# EAGLE design supply (EAGLE 6.3)
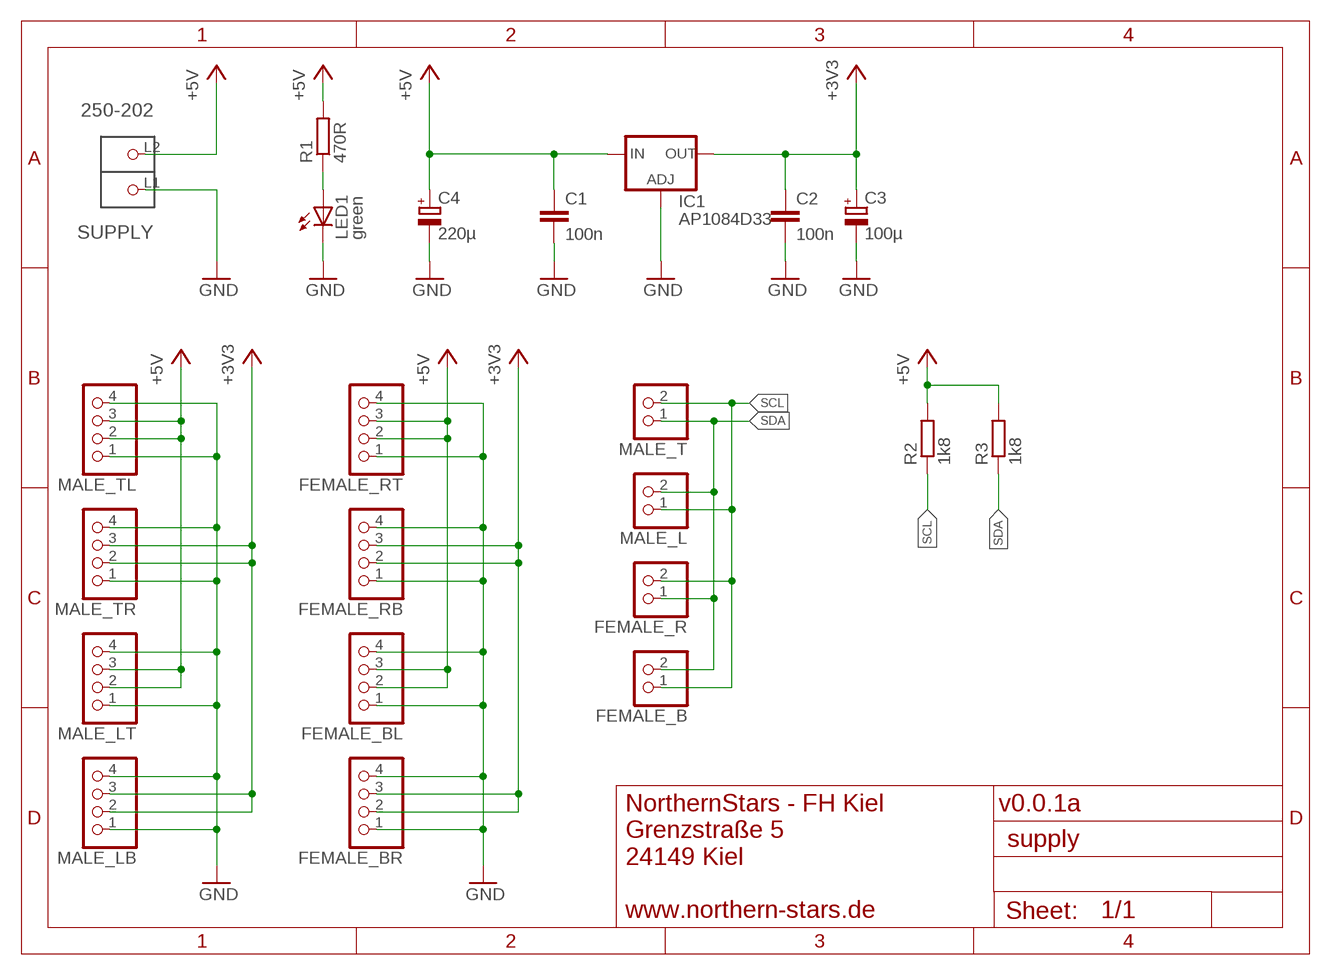
[diagram p0: schematic, sheet 1]

## Parts
C1  100n  C-EUC1206  [C1206]
C2  100n  C-EUC1206  [C1206]
C3  100µ  CPOL-EUUD-6,3X8,8  [UD-6,3X5,8_NICHICON]
C4  220µ  CPOL-EUUD-6,3X7,7  [UD-6,3X7,7_NICHICON]
FEMALE_B  PINHD-1X02_2.54-90°  [1X02/90]
FEMALE_BL  PINHD-1X04_2.54-90°  [1X04/90]
FEMALE_BR  PINHD-1X04_2.54-90°  [1X04/90]
FEMALE_R  PINHD-1X02_2.54-90°  [1X02/90]
FEMALE_RB  PINHD-1X04_2.54-90°  [1X04/90]
FEMALE_RT  PINHD-1X04_2.54-90°  [1X04/90]
IC1  AP1084D33  AP1084  [TO252]
LED1  green  LEDCHIPLED_1206  [CHIPLED_1206]
MALE_L  PINHD-1X02_2.54-90°  [1X02/90]
MALE_LB  PINHD-1X04_2.54-90°  [1X04/90]
MALE_LT  PINHD-1X04_2.54-90°  [1X04/90]
MALE_T  PINHD-1X02_2.54-90°  [1X02/90]
MALE_TL  PINHD-1X04_2.54-90°  [1X04/90]
MALE_TR  PINHD-1X04_2.54-90°  [1X04/90]
R1  470R  R-EU_R1206  [R1206]
R2  1k8  R-EU_R1206  [R1206]
R3  1k8  R-EU_R1206  [R1206]
SUPPLY  250-202  [P-250-202]

## Nets
+3V3: C2.1 C3.+ FEMALE_BR.2 FEMALE_BR.3 FEMALE_RB.2 FEMALE_RB.3 IC1.3(OUT) MALE_LB.2 MALE_LB.3 MALE_TR.2 MALE_TR.3
+5V: C1.1 C4.+ FEMALE_BL.2 FEMALE_BL.3 FEMALE_RT.2 FEMALE_RT.3 IC1.2(IN) MALE_LT.2 MALE_LT.3 MALE_TL.2 MALE_TL.3 R1.2 R2.2 R3.2 SUPPLY.L2(P2)
GND: C1.2 C2.2 C3.- C4.- FEMALE_BL.1 FEMALE_BL.4 FEMALE_BR.1 FEMALE_BR.4 FEMALE_RB.1 FEMALE_RB.4 FEMALE_RT.1 FEMALE_RT.4 IC1.1(ADJ) LED1.C MALE_LB.1 MALE_LB.4 MALE_LT.1 MALE_LT.4 MALE_TL.1 MALE_TL.4 MALE_TR.1 MALE_TR.4 SUPPLY.L1(P1)
N$1: LED1.A R1.1
SCL: FEMALE_B.1 FEMALE_R.2 MALE_L.1 MALE_T.2 R2.1
SDA: FEMALE_B.2 FEMALE_R.1 MALE_L.2 MALE_T.1 R3.1

## Notes on the sheet
- v0.0.1a
- NorthernStars - FH Kiel
  Grenzstraße 5
  24149 Kiel
  
  www.northern-stars.de

## Library data of the parts
C1 C2 = rcl:C-EU: CAPACITOR, European symbol
C3 C4 = rcl:CPOL-EU: POLARIZED CAPACITOR, European symbol
FEMALE_B FEMALE_R MALE_L MALE_T = pinhead-2:PINHD-1X02: PIN HEADER
FEMALE_BL FEMALE_BR FEMALE_RB FEMALE_RT MALE_LB MALE_LT MALE_TL MALE_TR = pinhead-2:PINHD-1X04: PIN HEADER
IC1 = v-reg-3:AP1084: AP1084 5A LOW DROPOUT POSITIVE ADJUSTABLE OR FIXED-MODE REGULATOR
LED1 = led:LED: LED OSRAM: - CHIPLED LG R971, LG N971, LY N971, LG Q971, LY Q971, LO R971, LY R971 LH N974, LH R974 LS Q976, LO Q976, LY Q976 LO Q996 - Hyper CHIPLED LW Q18S LB Q993, LB Q99A, LB R99A - SideLED LS A670, LO A670, LY A670, LG A670, LP A670 LB A673, LV A673, LT A673, LW A673 LH A674 LY A675 LS A676, LA A676, LO A676, LY A676, LW A676 LS A679, LY A679, LG A679 - Hyper Micro SIDELED® LS Y876, LA Y876, LO Y876, LY Y876 LT Y87S - SmartLED LW L88C, LW L88S LB L89C, LB L89S, LG L890 LS L89K, LO L89K, LY L89K LS L896, LA L896, LO L896, LY L896 - TOPLED LS T670, LO T670, LY T670, LG T670, LP T670 LSG T670, LSP T670, LSY T670, LOP T670, LYG T670 LG T671, LOG T671, LSG T671 LB T673, LV T673, LT T673, LW T673 LH T674 LS T676, LA T676, LO T676, LY T676, LB T676, LH T676, LSB T676, LW T676 LB T67C, LV T67C, LT T67C, LS T67K, LO T67K, LY T67K, LW E67C LS E67B, LA E67B, LO E67B, LY E67B, LB E67C, LV E67C, LT E67C LW T67C LS T679, LY T679, LG T679 LS T770, LO T770, LY T770, LG T770, LP T770 LB T773, LV T773, LT T773, LW T773 LH T774 LS E675, LA E675, LY E675, LS T675 LS T776, LA T776, LO T776, LY T776, LB T776 LHGB T686 LT T68C, LB T68C - Hyper Mini TOPLED® LB M676 - Mini TOPLED Santana® LG M470 LS M47K, LO M47K, LY M47K Source: http://www.osram.convergy.de LUXEON: - LUMILED® LXK2-PW12-R00, LXK2-PW12-S00, LXK2-PW14-U00, LXK2-PW14-V00 LXK2-PM12-R00, LXK2-PM12-S00, LXK2-PM14-U00 LXK2-PE12-Q00, LXK2-PE12-R00, LXK2-PE12-S00, LXK2-PE14-T00, LXK2-PE14-U00 LXK2-PB12-K00, LXK2-PB12-L00, LXK2-PB12-M00, LXK2-PB14-N00, LXK2-PB14-P00, LXK2-PB14-Q00 LXK2-PR12-L00, LXK2-PR12-M00, LXK2-PR14-Q00, LXK2-PR14-R00 LXK2-PD12-Q00, LXK2-PD12-R00, LXK2-PD12-S00 LXK2-PH12-R00, LXK2-PH12-S00 LXK2-PL12-P00, LXK2-PL12-Q00, LXK2-PL12-R00 Source: www.luxeon.com KINGBRIGHT: KA-3528ASYC Source: www.kingbright.com
R1-R3 = rcl:R-EU_: RESISTOR, European symbol
SUPPLY = con-wago_250:250-202: Serie 250, 1-Leiter-Klemmenleiste für Leiterplatten 1 Lötstift/Pol versetzt / Series 250, 1-conductor PCB terminal strip 1 solder pin/pole, staggered Polzahl / Pole No.: 2 Rastermaß / Pitch: 3.5 mm Bemessungsspannung / Rated Voltage: 320 V Nennstrom / Nominal Current: 8 A Leiterquerschnitt / Conductor Size: 0.2 - 1.5 mm² Anschlusstechnik / Connection Technology: Steckklemm-Anschluss Lötstiftlänge: / Solder Pin Length: 3.6 mm Leitereinführung (zur Platine) / Conductor entry angle (to PCB): 45 ° Farbe / Color: grau / gray Stand: 01.01.2012. Die jeweils aktuellen Daten zu diesem Artikel finden Sie in unserem Produktkatalog, den Sie unter www.wago.com einsehen können. As of: 01/01/2012. Please find the newest data for this article in our product catalogue, which can be viewed under www.wago.com.

## Board
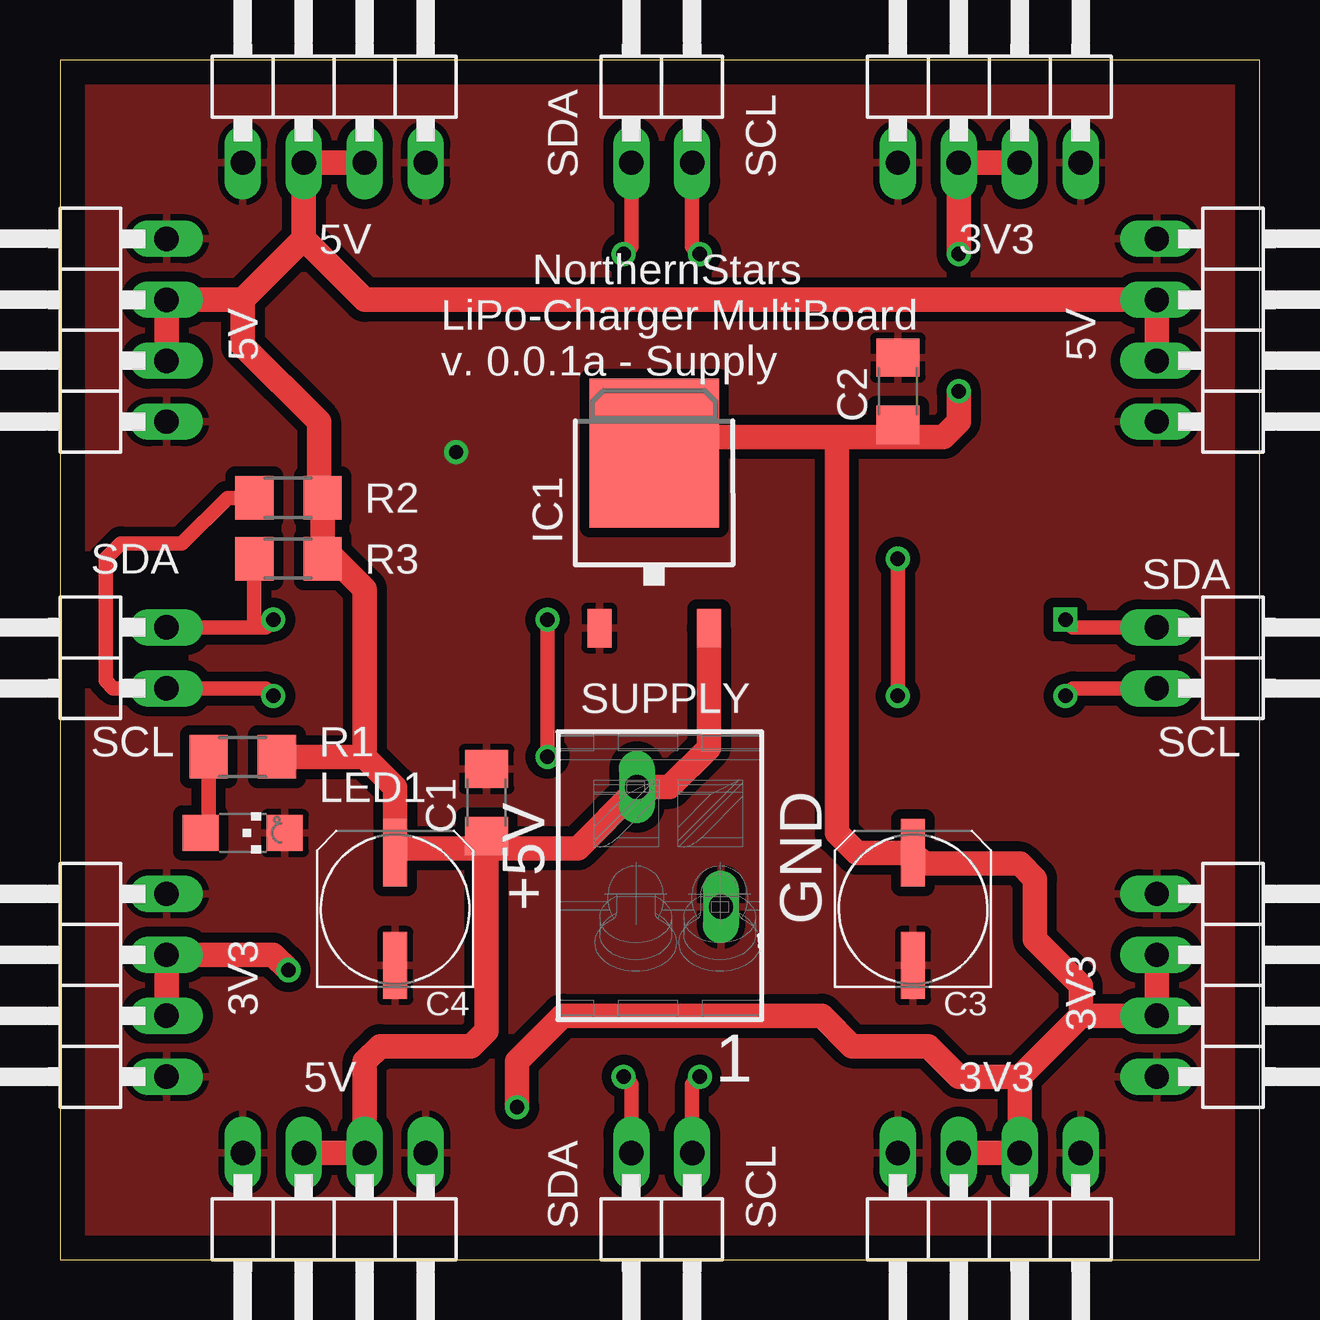
[diagram p1: board, top side]
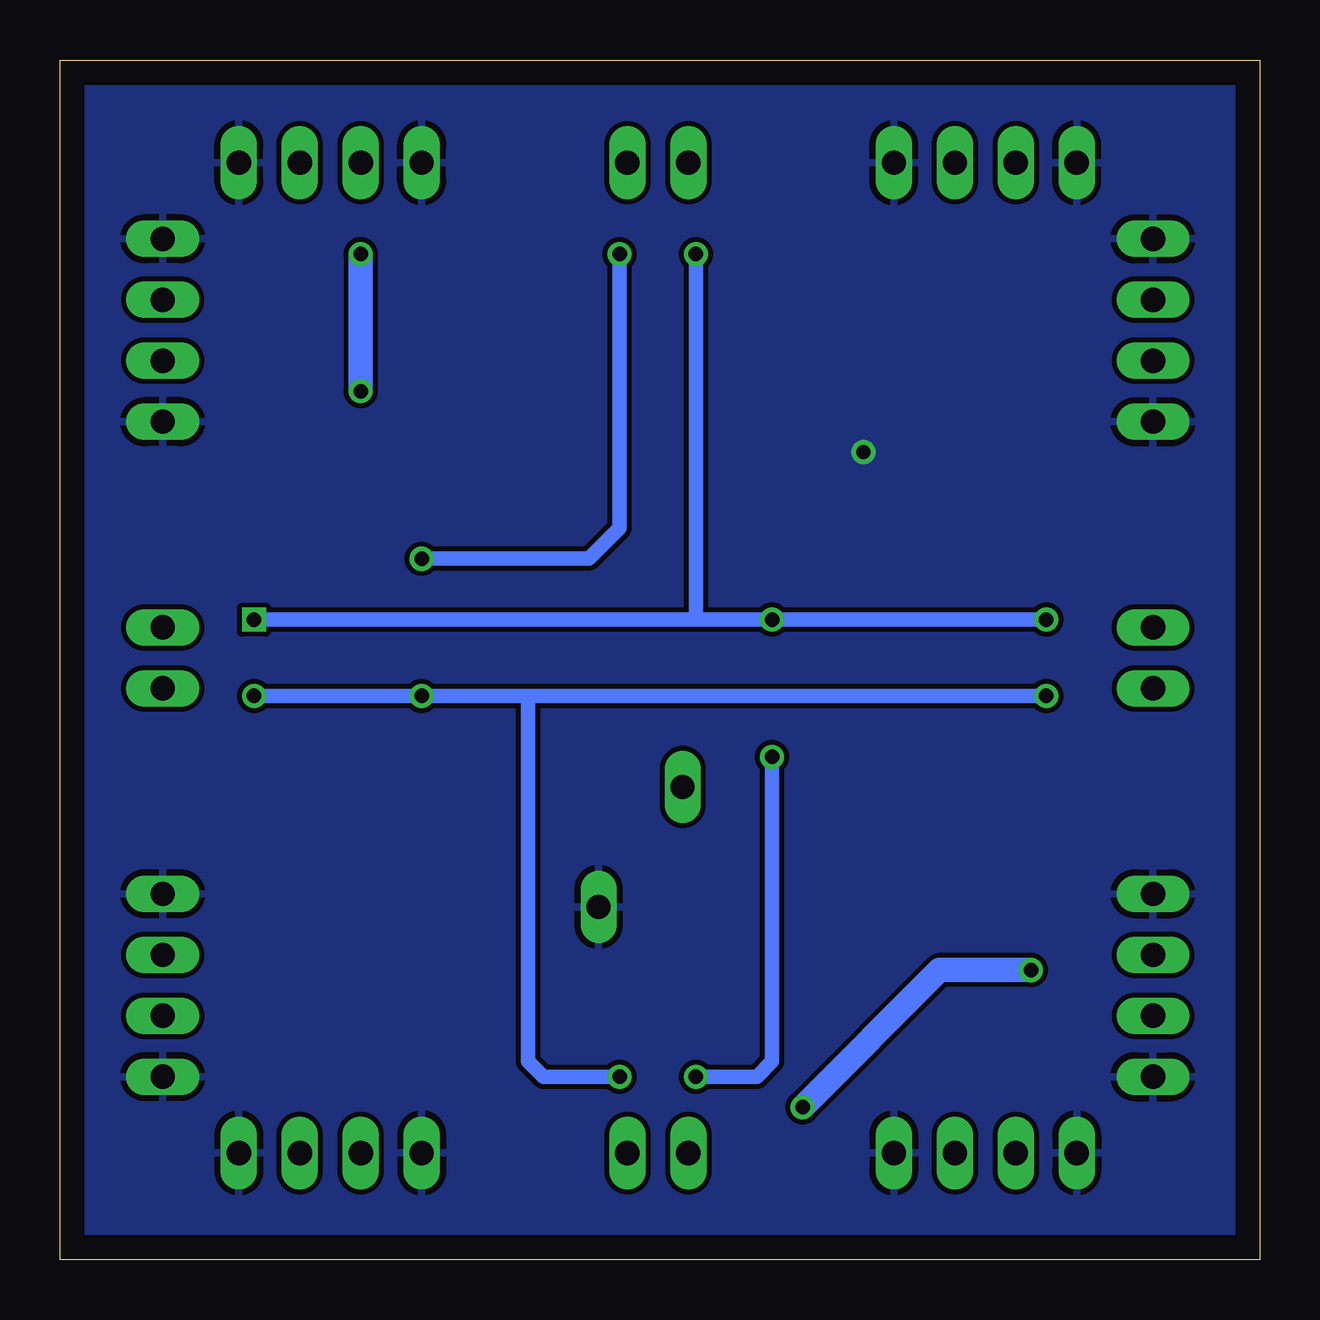
[diagram p2: board, bottom side, seen from below]

Size 50 x 50 mm. Coordinates in mm from the lower left corner, seen from the top.
Outline: 0,0 50,0 50,50 0,50 0,0
Copper layers (1*16): Top 0.035mm / dielectric 1.5mm / Bottom 0.035mm
Design rules "default": minimum track width 10mil, minimum drill 24mil, track to track 8mil, track to pad 8mil, pad to pad 8mil, via to via 8mil, smd to smd 8mil, copper to edge 40mil, drill to drill 8mil, minimum pad ring 10mil, minimum via ring 8mil, stop-mask expansion 4mil, vias tented up to drill 0mil, thermal gap 10mil

### Footprints (pad centres in the part's own frame; a part is rotated, then mirrored left to right if it is on the bottom)
C1206 = smd 1.6 x 1.8: 1 -1.4,0; 2 1.4,0
UD-6,3X5,8_NICHICON = smd 2.8 x 1: + 2.35,0; - -2.35,0
UD-6,3X7,7_NICHICON = smd 2.8 x 1: + 2.35,0; - -2.35,0
1X02/90 = drill 1.016 long: 1 -2.54,-3.81; 2 0,-3.81
1X04/90 = drill 1.016 long: 1 -3.81,-3.81; 2 -1.27,-3.81; 3 1.27,-3.81; 4 3.81,-3.81
TO252 = smd 1 x 1.6: 1 -2.28,-6.07; 2 2.28,-6.07 | smd 5.4 x 6.2: 3 0,1.23
CHIPLED_1206 = smd 1.5 x 1.5: A 0,-1.75; C 0,1.75
R1206 = smd 1.6 x 1.803: 1 -1.422,0; 2 1.422,0
P-250-202 = drill 1 long: L1 1.3,2.55; L2 -3.7,-0.95

### Placement (x,y rotation side)
C1  17.78,19.05 90 top
C2  34.92,36.2 90 top
C3  35.56,14.61 90 top
C4  13.97,14.61 90 top
FEMALE_B  23.81,0.64 180 top
FEMALE_BL  11.43,0.64 180 top
FEMALE_BR  38.73,0.64 180 top
FEMALE_R  49.53,23.81 270 top
FEMALE_RB  49.53,11.43 270 top
FEMALE_RT  49.53,38.73 270 top
IC1  24.77,32.38 0 top
LED1  7.62,17.78 270 top
MALE_L  0.64,26.35 90 top
MALE_LB  0.64,11.43 90 top
MALE_LT  0.64,38.73 90 top
MALE_T  26.35,49.53 0 top
MALE_TL  11.43,49.53 0 top
MALE_TR  38.73,49.53 0 top
R1  7.62,20.95 0 top
R2  9.53,31.75 0 top
R3  9.53,29.21 0 top
SUPPLY  25,16 270 top

### Tracks (layer width: path | path; a pad name or v marks a point on that pad's centre or on a via)
+3V3  (via drill 0.6)
  Top 1.016: 40.01,7.62 42.55,10.16 | v9.53,12.06 8.89,12.7 MALE_LB.3 MALE_LB.2 | v37.47,36.2 37.47,34.92 36.83,34.29 34.92,34.29 | 34.92,34.29 32.38,34.29 | 32.38,34.29 25.44,34.29 IC1.3 | C2.1 34.92,34.29 | 32.38,34.29 32.38,17.78 33.21,16.95 C3.+ 36.01,16.51 40.01,16.51 40.64,15.88 40.64,13.34 42.55,11.43 42.55,10.16 | v19.05,6.35 19.05,8.26 20.95,10.16 31.75,10.16 33.02,8.89 36.2,8.89 37.47,7.62 40.01,7.62 | FEMALE_BR.3 FEMALE_BR.2 40.01,7.62 | 42.55,10.16 FEMALE_RB.3 FEMALE_RB.2 | v37.47,41.91 MALE_TR.2 MALE_TR.3
  Bottom 1.016: v9.53,12.06 13.34,12.06 v19.05,6.35 | v37.47,41.91 v37.47,36.2
+5V
  Top 1.016: 17.78,17.14 21.59,17.14 24.05,19.61 SUPPLY.L2 25.41,19.7 27.05,21.33 IC1.2 | 17.78,17.14 14.16,17.14 C4.+ 13.97,19.68 12.7,20.95 | C1.1 17.78,17.14 | R1.2 12.7,20.95 | 12.7,20.95 12.7,27.94 11.43,29.21 R3.2 R2.2 10.79,31.9 10.79,34.92 7.62,38.1 7.62,40.01 | 17.78,17.14 17.78,9.53 17.14,8.89 13.34,8.89 12.7,8.26 FEMALE_BL.2 FEMALE_BL.3 | 7.62,40.01 10.16,42.55 | 10.16,42.55 12.7,40.01 FEMALE_RT.2 FEMALE_RT.3 | MALE_TL.3 MALE_TL.2 10.16,42.55 | 7.62,40.01 MALE_LT.3 MALE_LT.2
GND  (via drill 0.6)
  other vias: 16.51,33.66
  pour Top (isolate 0.406): 0,0 0,50.16 50.16,50.16 50.16,0
  pour Bottom: 0,0 0,50.16 50.16,50.16 50.16,0
N$1
  Top 0.61: LED1.A 6.2,18.11 R1.1
SCL  (via drill 0.6)
  Top 0.61: v41.91,23.5 42.23,23.81 FEMALE_R.2 | 4.13,23.81 MALE_L.1 | MALE_L.1 8.57,23.81 v8.89,23.5 | v26.67,41.91 26.35,42.23 MALE_T.2 | v34.92,29.21 v34.92,23.5 | FEMALE_B.1 26.35,7.3 v26.67,7.62 | MALE_L.1 2.22,23.81 1.91,24.13 1.91,29.21 2.54,29.84 5.08,29.84 6.99,31.75 R2.1
  Bottom 0.61: v41.91,23.5 v34.92,23.5 30.48,23.5 | 30.48,23.5 v8.89,23.5 | v26.67,41.91 26.67,30.48 27.94,29.21 v34.92,29.21 | v26.67,7.62 29.84,7.62 30.48,8.26 30.48,23.5
SDA  (via drill 0.6)
  Top 0.61: MALE_L.2 8.26,26.35 | 8.26,26.35 8.57,26.35 v8.89,26.67 | v23.5,41.91 23.81,42.23 MALE_T.1 | FEMALE_B.2 23.81,7.3 v23.5,7.62 | v20.32,20.95 v20.32,26.67 | FEMALE_R.1 42.23,26.35 v41.91,26.67 | R3.1 8.1,26.5 8.26,26.35
  Bottom 0.61: v41.91,26.67 23.5,26.67 | 23.5,26.67 v20.32,26.67 v8.89,26.67 | v23.5,41.91 23.5,26.67 | v23.5,7.62 20.95,7.62 20.32,8.26 v20.32,20.95

### Text on the board
tPlace: NorthernStars | LiPo-Charger MultiBoard | v. 0.0.1a - Supply
tNames: SDA | SCL | 5V | 3V3 | 5V | 5V | SDA | SDA | SCL | SCL | +5V | GND | 3V3 | 3V3 | 5V | 3V3 | SDA | SCL